# Altium project MCS-CDCUnit.PrjPcb
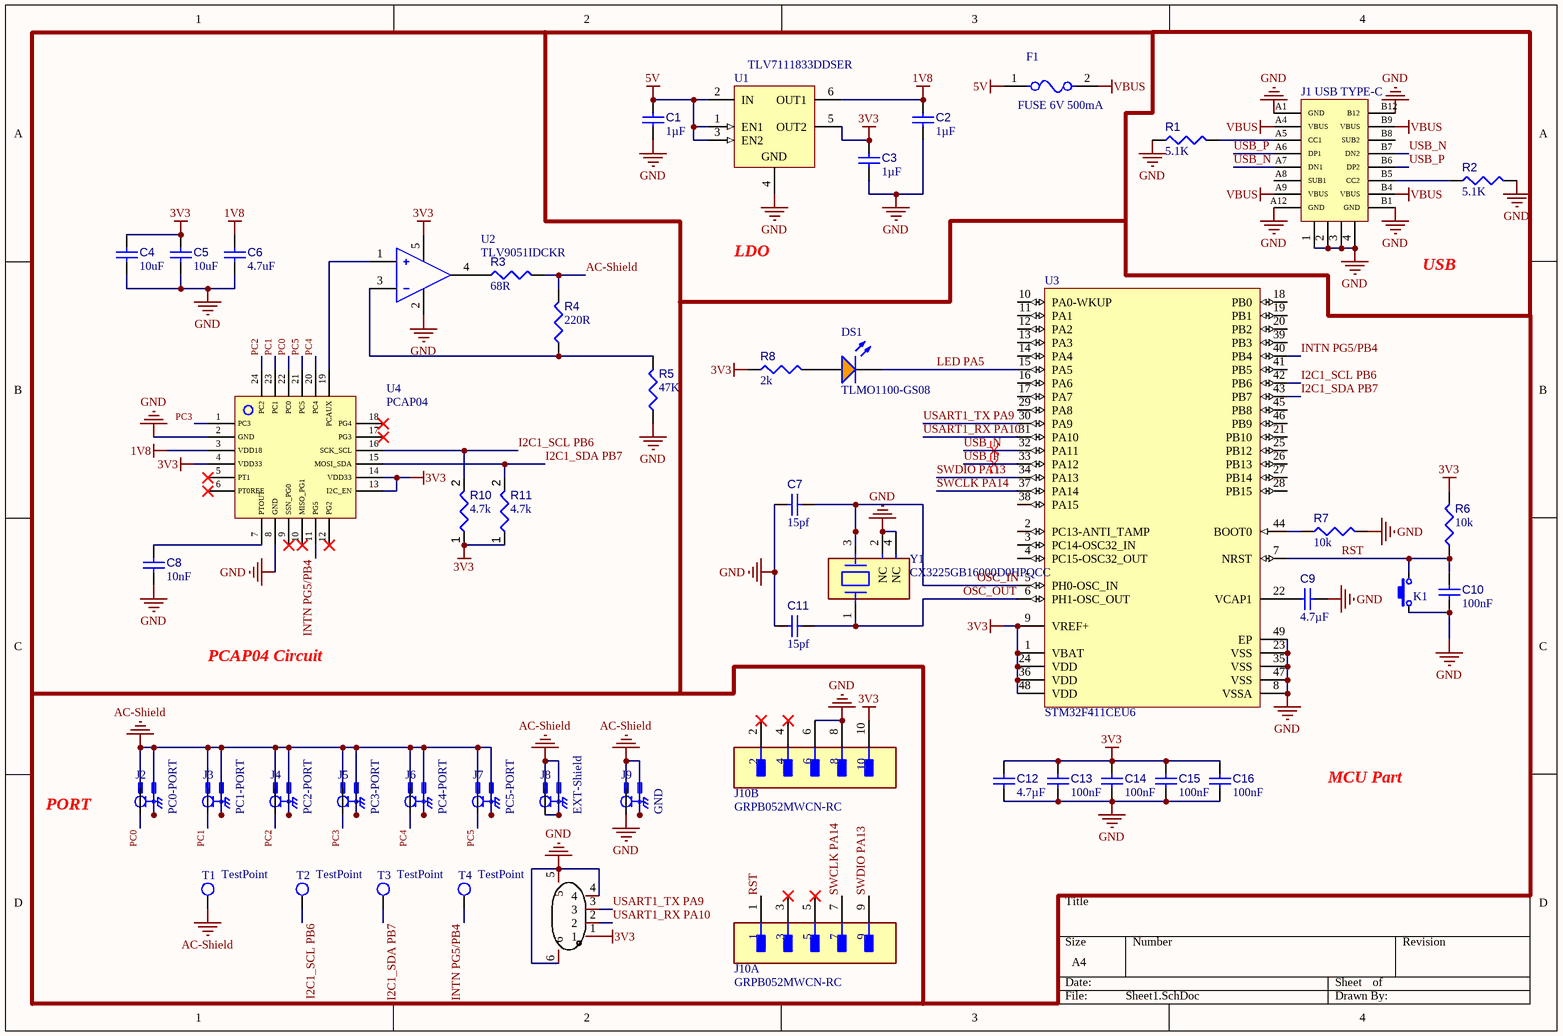
[diagram p0: Sheet1.SchDoc]
1 sheet, 49 parts. Net scope: global (net labels, ports and power ports of the same name join across sheets).
Board file: PCB1.PcbDoc

## Sheet Sheet1.SchDoc
size A4; SheetNumber: 1; SheetTotal: 1; SPICEModelCacheTWQJCMND: <root> / <DocumentId>TWQJCMND</DocumentId> / </root>

### Parts
C1  value 1µF  [CAPC0402(1005)60_L]  (hidden comment: Capacitor 1µF +/-20% 10V 0402)
C2  value 1µF  [CAPC0402(1005)60_L]  (hidden comment: Capacitor 1µF +/-20% 10V 0402)
C3  value 1µF  [CAPC0402(1005)60_L]  (hidden comment: Capacitor 1µF +/-20% 10V 0402)
C4  value 10uF  [CAPC0402(1005)60_L]  (hidden comment: Capacitor 10µF +/-40% 6.3V 0402)
C5  value 10uF  [CAPC0402(1005)60_L]  (hidden comment: Capacitor 10µF +/-40% 6.3V 0402)
C6  value 4.7uF  [CAPC0402(1005)60_L]  (hidden comment: Capacitor 10µF +/-40% 6.3V 0402)
C7  value 15pf  [CAPC0402(1005)60_L]  (hidden comment: Capacitor 100nF +/-20% 25V 0402)
C8  value 10nF  [CAPC0402(1005)60_L]  (hidden comment: Capacitor 10nF +/-20% 50V 0402)
C9  value 4.7µF  [CAPC0603(1608)100_L]  (hidden comment: Capacitor 4.7µF +/-20% 10V 0603)
C10  value 100nF  [CAPC0402(1005)60_L]  (hidden comment: Capacitor 100nF +/-20% 25V 0402)
C11  value 15pf  [CAPC0402(1005)60_L]  (hidden comment: Capacitor 100nF +/-20% 25V 0402)
C12  value 4.7µF  [CAPC0603(1608)100_L]  (hidden comment: Capacitor 4.7µF +/-20% 10V 0603)
C13  value 100nF  [CAPC0402(1005)60_L]  (hidden comment: Capacitor 100nF +/-20% 25V 0402)
C14  value 100nF  [CAPC0402(1005)60_L]  (hidden comment: Capacitor 100nF +/-20% 25V 0402)
C15  value 100nF  [CAPC0402(1005)60_L]  (hidden comment: Capacitor 100nF +/-20% 25V 0402)
C16  value 100nF  [CAPC0402(1005)60_L]  (hidden comment: Capacitor 100nF +/-20% 25V 0402)
CN1  SH1.0-4P  [CONN-SMD_4P-P1.00_WF10004-01200]  (value not drawn)
DS1  TLMO1100-GS08  [VISH-TLMX1100-2_V]
F1  FUSE 6V 500mA  [FP-0603L-MFG]
J1  USB TYPE-C  [TYPE-C-16P]
J2  PC0-PORT  [LINX_CONMHF4-SMD-G-T]
J3  PC1-PORT  [LINX_CONMHF4-SMD-G-T]
J4  PC2-PORT  [LINX_CONMHF4-SMD-G-T]
J5  PC3-PORT  [LINX_CONMHF4-SMD-G-T]
J6  PC4-PORT  [LINX_CONMHF4-SMD-G-T]
J7  PC5-PORT  [LINX_CONMHF4-SMD-G-T]
J8  EXT-Shield  [LINX_CONMHF4-SMD-G-T]
J9  GND  [LINX_CONMHF4-SMD-G-T]
J10  GRPB052MWCN-RC  [FP-GRPB052MWCN-RC-MFG]  (parts A,B of 2)
K1  Button  [SW-SMD_ST-1185X]  (value not drawn)
R1  value 5.1K  [RESC0402(1005)_L]  (hidden comment: Resistor 10K  +/-1 % 0402 63 mW)
R2  value 5.1K  [RESC0402(1005)_L]  (hidden comment: Resistor 10K  +/-1 % 0402 63 mW)
R3  value 68R  [RESC0402(1005)_L]  (hidden comment: Resistor 10R  +/-1 % 0402 63 mW)
R4  value 220R  [RESC0402(1005)_L]  (hidden comment: Resistor 10R  +/-1 % 0402 63 mW)
R5  value 47K  [RESC0402(1005)_L]  (hidden comment: Resistor 10R  +/-1 % 0402 63 mW)
R6  value 10k  [RESC0402(1005)_L]  (hidden comment: Resistor 10K  +/-1 % 0402 63 mW)
R7  value 10k  [RESC0402(1005)_L]  (hidden comment: Resistor 10K  +/-1 % 0402 63 mW)
R8  value 2k  [RESC0402(1005)_L]  (hidden comment: Resistor 10K  +/-1 % 0402 63 mW)
R10  value 4.7k  [RESC0402(1005)_L]  (hidden comment: Resistor 4K7  +/-1 % 0402 63 mW)
R11  value 4.7k  [RESC0402(1005)_L]  (hidden comment: Resistor 4K7  +/-1 % 0402 63 mW)
T1  TestPoint  [TestPoint]
T2  TestPoint  [TestPoint]
T3  TestPoint  [TestPoint]
T4  TestPoint  [TestPoint]
U1  TLV7111833DDSER  [DSE0006A_V]
U2  TLV9051IDCKR  [FP-DCK0005A-IPC_A]
U3  STM32F411CEU6  [STM-UFQFPN48_N]
U4  PCAP04  [QFN-24-PAD]
Y1  CX3225GB16000D0HPQCC  [FP-CX3225GB-MFG]

### Nets
1V8: C2.1 C6.2 U1.6(OUT1) U4.3(VDD18)
3V3: C3.1 C4.2 C5.2 C12.2 C13.2 C14.2 C15.2 C16.2 CN1.1 J10.10 R6.2 R8.1 R10.1 R11.1 U1.5(OUT2) U2.5(V+) U3.1(VBAT) U3.9(VREF+) U3.24(VDD) U3.36(VDD) U3.48(VDD) U4.4(VDD33) U4.13(I2C_EN) U4.14(VDD33)
5V: C1.1 F1.1 U1.1(EN1) U1.2(IN) U1.3(EN2)
AC-Shield: J2.S1 J2.S2 J2.S3 J3.S1 J3.S2 J3.S3 J4.S1 J4.S2 J4.S3 J5.S1 J5.S2 J5.S3 J6.S1 J6.S2 J6.S3 J7.S1 J7.S2 J7.S3 J8.1 J8.S1 J8.S2 J8.S3 J9.S1 J9.S2 J9.S3 R3.2 R4.2 T1.1
GND: C1.2 C2.2 C3.2 C4.1 C5.1 C6.1 C7.2 C8.1 C9.2 C10.1 C11.2 C12.1 C13.1 C14.1 C15.1 C16.1 CN1.4 CN1.5 CN1.6 J1.1 J1.2 J1.3 J1.4 J1.A1(GND) J1.A12(GND) J1.B1(GND) J1.B12 J9.1 J10.6 J10.8 K1.1 R1.1 R2.2 R5.1 R7.2 U1.4(GND) U2.2(V-) U3.8(VSSA) U3.23(VSS) U3.35(VSS) U3.47(VSS) U3.49(EP) U4.2(GND) U4.8(GND) Y1.2(NC) Y1.4(NC)
VBUS: F1.2 J1.A4(VBUS) J1.A9(VBUS) J1.B4(VBUS) J1.B9(VBUS)
I2C1_SCL PB6: R10.2 T2.1 U3.42(PB6) U4.16(SCK_SCL)
I2C1_SDA PB7: R11.2 T3.1 U3.43(PB7) U4.15(MOSI_SDA)
INTN PG5/PB4: T4.1 U3.40(PB4) U4.11(PG5)
LED PA5: DS1.2(K) U3.15(PA5)
OSC_IN: C7.1 U3.5(PH0-OSC_IN) Y1.3(2_HOT)
OSC_OUT: C11.1 U3.6(PH1-OSC_OUT) Y1.1(1_HOT)
PC0: J2.1 U4.22(PC0)
PC1: J3.1 U4.23(PC1)
PC2: J4.1 U4.24(PC2)
PC3: J5.1 U4.1(PC3)
PC4: J6.1 U4.20(PC4)
PC5: J7.1 U4.21(PC5)
RST: C10.2 J10.1 K1.2 R6.1 U3.7(NRST)
SWCLK PA14: J10.7 U3.37(PA14)
SWDIO PA13: J10.9 U3.34(PA13)
USART1_RX PA10: CN1.2 U3.31(PA10)
USART1_TX PA9: CN1.3 U3.30(PA9)
USB_N: J1.A7(DN1) J1.B7(DN2) U3.32(PA11)
USB_P: J1.A6(DP1) J1.B6(DP2) U3.33(PA12)
NetC8_2: C8.2 U4.7(PTOUT)
NetC9_1: C9.1 U3.22(VCAP1)
NetDS1_1: DS1.1(A) R8.2
NetJ1_A5: J1.A5(CC1) R1.2
NetJ1_B5: J1.B5(CC2) R2.1
NetR3_1: R3.1 U2.4(OUT)
NetR4_1: R4.1 R5.2 U2.3(IN-)
NetR7_1: R7.1 U3.44(BOOT0)
NetU2_1: U2.1(IN+) U4.19(PCAUX)

Not connected (* = marked no-connect by the designer): J1 A8(SUB1) B8(SUB2); J10 2* 3* 4* 5*; U3 2(PC13-ANTI_TAMP) 3(PC14-OSC32_IN) 4(PC15-OSC32_OUT) 10(PA0-WKUP) 11(PA1) 12(PA2) 13(PA3) 14(PA4) 16(PA6) 17(PA7) 18(PB0) 19(PB1) 20(PB2) 21(PB10) 25(PB12) 26(PB13) 27(PB14) 28(PB15) 29(PA8) 38(PA15) 39(PB3) 41(PB5) 45(PB8) 46(PB9); U4 5(PT1)* 6(PT0REF)* 9(SSN_PG0)* 10(MISO_PG1)* 12(PG2)* 17(PG3)* 18(PG4)*

### Layout directives
differential pair: USB_N, USB_P

### Notes on the sheet
- LDO
- USB
- PCAP04 Circuit
- MCU Part
- PORT

### Library data of the parts
C1-C3 = CMP-001-00063-3: Chip Capacitor, 1µF +/-20%, 10V, 0402, Thickness 0.6 mm; Tolerance: 10%; Mounting Technology: SMT; Max Operating Temperature: 85°C; Voltage Rating: 10V; Pins: 2; Case/Package: 0402; Min Operating Temperature: -55°C
C4-C6 = CMP-001-00074-3: Chip Capacitor, 10µF +/-40%, 6.3V, 0402, Thickness 0.6 mm; Tolerance: 10%; Case/Package: 0402; Pins: 2; Mounting Technology: SMT; Voltage Rating: 6.3V; Max Operating Temperature: 85°C; Min Operating Temperature: -55°C
C7 C10 C11 C13-C16 = CMP-001-00065-4: Chip Capacitor, 100nF +/-20%, 25V, 0402, Thickness 0.6 mm; Tolerance: 10%; Max Operating Temperature: 85°C; Min Operating Temperature: -55°C; Pins: 2; Voltage Rating: 25V; Mounting Technology: SMT; Case/Package: 0402
C8 = CMP-001-00069-3: Chip Capacitor, 10nF +/-20%, 50V, 0402, Thickness 0.6 mm; Tolerance: 5%; Max Operating Temperature: 85°C; Pins: 2; Case/Package: 0402; Voltage Rating: 50V; Min Operating Temperature: -55°C; Mounting Technology: SMT
C9 C12 = CMP-001-00076-4: Chip Capacitor, 4.7µF +/-20%, 10V, 0603, Thickness 1 mm; Tolerance: 10%; Mounting Technology: SMT; Case/Package: 0603; Pins: 2; Min Operating Temperature: -55°C; Max Operating Temperature: 85°C; Voltage Rating: 10V
CN1 = SH1.0-4P: 连接器; Manufacturer: ATOM(爱特姆); Name: WF10004-01200; Add into BOM: yes; Pitch: 1mm; Pins Structure: 1x4P; Number of PINs Per Row: 4; Gender: 公型插针; Current Rating (Max): 500mA; Symbol: WF10004-01200; Device: WF10004-01200; LCSC Part Name: 1mm 1x4P 卧贴; Supplier Part: C479990; Manufacturer Part: WF10004-01200; Supplier Footprint: SMD,P=1mm; JLCPCB Part Class: Extended Part; Datasheet: https://atta.szlcsc.com/upload/public/pdf/source/20200107/C479990_7EE1728C707014A64676B41D860FB4D7.pdf; Supplier: LCSC; Convert to PCB: yes; Reference Series: -; Number of Rows: 1; Row Spacing: -; Mounting Style: 卧贴; Operating Temperature Range: -25℃~+85℃
DS1 = CMP-007-00029-2: Orange LED, 20 mA, 2.1 V, -40 to 100 degC, 2-Pin SMD (0603), RoHS, Tape and Reel; Manufacturer: Vishay Semiconductor; Lens Style: Diffused; Forward Current: 20mA; Viewing Angle: 160degrees; Nominal Vf: 2.1V; Power: 90mW; Luminous Intensity: 80mcd; Max Operating Temperature: 100°C; Manufacturer URL: http://www.vishay.com/; Datasheet URL: http://download.siliconexpert.com/pdfs/2016/8/7/12/43/26/667/vsh_/manual/379263299541529tlmb1100.pdf; Datasheet Version: Rev. 2.7, 03/2016; Illumination Colour: Orange; Package Quantity: 3000; Package Reference: 0603; Pins: 2; Min Operating Temperature: -40°C; Package Description: 2-Pin Surface Mount Device, Body 1.6 x 0.8 mm; RoHS Compliant: True; Case/Package: 0603; Mounting Technology: SM; Colour: Orange; Packaging: TapeandReel; Forward Voltage: 2.1V
F1 = CMP-08606-000025-1: PTC RESET FUSE 15V 100MA 0603; Manufacturer Part Number: 0603L010YR; Manufacturer: Littelfuse Inc; Current Rating: 40A; Resistance: 0.9-6Ω; Value: 0.9-6Ω; Hold Current: 0.1A; Trip Time: 1s; Trip Current: 0.3A; Device Class L1: Circuit Protection; Digikey Description: PTC RESET FUSE 15V 100MA 0603; Height: 0.75mm; Temperature Range Low: -40°C; Package: 0603L; Lead Free: Yes; Temperature Range High: +85°C; Device Class L3: unset; Category: Fuse; RoHS: TRUE; Voltage Rating: 15V; Automotive: No; Temperature: -40°C to +85°C; Mouser Description: Resettable Fuses - PPTC PTC 15V 0603 .100A POLY SURF MOUNT; Octopart: https://octopart.com/0603l010yr-littelfuse-8316166; Ambient Temperature Range Low: -40°C; ComponentLink2Description: Datasheet; Device Class L2: PTC Resettable Fuses; Ambient Temperature Range High: +85°C; ComponentLink2URL: https://www.littelfuse.com/~/media/electronics/datasheets/resettable_ptcs/littelfuse_ptc_0603l_datasheet.pdf.pdf
J1 = USB TYPE-C: USB TYPE-C 母座
J2-J9 = CMP-002-00072-1: IPEX MHF4 Connector Jack, Male Pin 50Ohm Surface Mount Solder; MF: Linx Technologies Inc.; MP: CONMHF4-SMD-G-T; Design Item ID: CONMHF4-SMD-G-T; Availability: In Stock; SnapEDA_Link: https://www.snapeda.com/parts/CONMHF4-SMD-G-T/Linx/view-part/?ref=snap; Pins: 4; Purchase-URL: https://pricing.snapeda.com/search/part/CONMHF4-SMD-G-T/?ref=eda; Case/Package: None; Check_prices: https://www.snapeda.com/parts/CONMHF4-SMD-G-T/Linx/view-part/?ref=eda; Price: None; Source: CONMHF4-SMD-G-T.SchLib; Component Type: Standard; Value: *
J10 = CMP-25680-000005-1: CONN HEADER R/A 10POS 1.27MM; Manufacturer: Sullins; Conn Orientation: Right Angle; Current Rating: 1A; Conn Gender: Male; Number Of Contacts: 10; ComponentLink2Description: Datasheet; Lead Free: Yes; Footprint Url: https://drawings-pdf.s3.amazonaws.com/11020.pdf; Pitch: 1.27mm; Temperature: -40°C to +105°C; Temperature Range High: +105°C; Digikey Description: CONN HEADER R/A 10POS 1.27MM; Automotive: No; Package: 0; Temperature Range Low: -40°C; Device Class L1: Connectors; Octopart: https://octopart.com/grpb052mwcn-rc-sullins-12268864; RoHS: TRUE; Number Of Rows: 2; ComponentLink2URL: https://s3.amazonaws.com/catalogspreads-pdf/PAGE94-95%20.050%20MALE%20HDR%20ST%20RA%20SMT.pdf; Height: 3.6mm; Category: Conn; Contact Material: Gold; Device Class L3: unset; Device Class L2: Headers and Wire Housings; Manufacturer Part Number: GRPB052MWCN-RC
R1 R2 R6-R8 = CMP-009-00149-3: Chip Resistor, 10 kOhms, +/-1 %, 63 mW, -55 to 125 degC, 0402; Power: 63mW; Tolerance: 1%; Min Operating Temperature: -55°C; Case/Package: 0402; Max Operating Temperature: 155°C; Pins: 2
R3-R5 = CMP-009-00152-3: Chip Resistor, 10 Ohms, +/-1 %, 63 mW, -55 to 155 degC, 0402; Tolerance: 1%; Power: 63mW; Pins: 2; Max Operating Temperature: 155°C; Min Operating Temperature: -55°C; Case/Package: 0402
R10 R11 = CMP-009-00158-3: Chip Resistor, 4,7 kOhms, +/-1 %, 63 mW, -55 to 155 degC, 0402; Power: 63mW; Tolerance: 1%; Max Operating Temperature: 155°C; Pins: 2; Min Operating Temperature: -55°C; Case/Package: 0402
U1 = CMP-0389-00123-2: Dual Output High PSRR LDO, 200 mA, Fixed 1.8, 3.3 V Output, 2 to 5.5 V Input, 6-pin WSON (DSE), -40 to 125 degC, Green (RoHS & no Sb/Br); Manufacturer: Texas Instruments; SubFamily: Dual Channel LDO; Vin(Min)(V): 2; Vdo(Typ)(mV): 150; Iout(Max)(A): 0.2; Vin(Max)(V): 5.5; Iq(Typ)(mA): 0.03; PackageDescription: 6-Pin Plastic Small Outline, Body 1.5 x 1.5 mm, Pitch 0.5 mm; PackageVersion: 4207810/A; PackageReference: DSE0006A; Eco-Plan: Green (RoHS & no Sb/Br); ComponentLink3Description: Package Specification; ComponentLink1URL: http://www.ti.com/; ComponentLink1Description: Manufacturer URL; PartNumber: TLV7111833DDSER; Fixed Output Options(V): 1.8, 3.3; DatasheetVersion: SBVS142A; Mounting Technology: Surface Mount; ComponentLink3URL: http://www.ti.com/litv/pdf/mpds287; ComponentLink2URL: http://www.ti.com/general/docs/lit/getliterature.tsp?genericPartNumber=TLV7111833D&fileType=pdf; ComponentLink2Description: Datasheet
U2 = CMP-04895-000451-1: IC OPAMP GP 1 CIRCUIT SC70-5
U3 = CMP-0243-00165-1: ARM Cortex-M4 32-bit MCU+FPU, 512 KB Flash, 128 KB RAM, 36 I/Os, 48-Pin UFQFPN, -40 to 85 degC, Tray; Operating Frequency(F) (Processor speed) (MHz): 100; FLASH Size (Prog) (kB): 512; Internal RAM Size (kB): 128; I/Os (High Current): 36; Supply Voltage(Vcc) min (V): 1.7; Package Reference: 48-Pin Ultra Thin Fine Pitch Quad Flat No-Lead, 7 x 7 x 0.6 mm Body, 0.5 mm Pitch, Exposed Pad; ComponentLink1Description: Manufacturer URL; ComponentLink1URL: http://www.st.com/; Packing: Tray; Package Description: UFQFPN48; Core: ARM Cortex-M4; ComponentLink2Description: Datasheet; ComponentLink2URL: http://www.st.com/st-web-ui/static/active/en/resource/technical/document/datasheet/DM00115249.pdf; DatasheetVersion: Rev. 6; Mounting Technology: Surface Mount
U4 = PCAP04: CDC IC
Y1 = CMP-20727-000007-1: CRYSTAL 16.0000MHZ 8PF SMD; Tolerance: 20ppm; Frequency: 16MHz; Series Resistance: 80R; Frequency Stability: 30ppm; Width: 0.098inch; RoHS Compliant: Yes; Package Quantity: 3000; Weight: 0.000564oz; Length: 0.126inch; Max Operating Temperature: 85°C; Case/Package: SMD/SMT; Lead Free: Lead Free; Packaging: Tape and Reel; Min Operating Temperature: -40°C; Load Capacitance: 8pF; ESR (Equivalent Series Resistance): 80R; Mount: Surface Mount; Termination: SMD/SMT; Frequency Tolerance: 20ppm; Height: 0.035inch